# EasyEDA Pro project my_supercap_1.eprj, board 上板
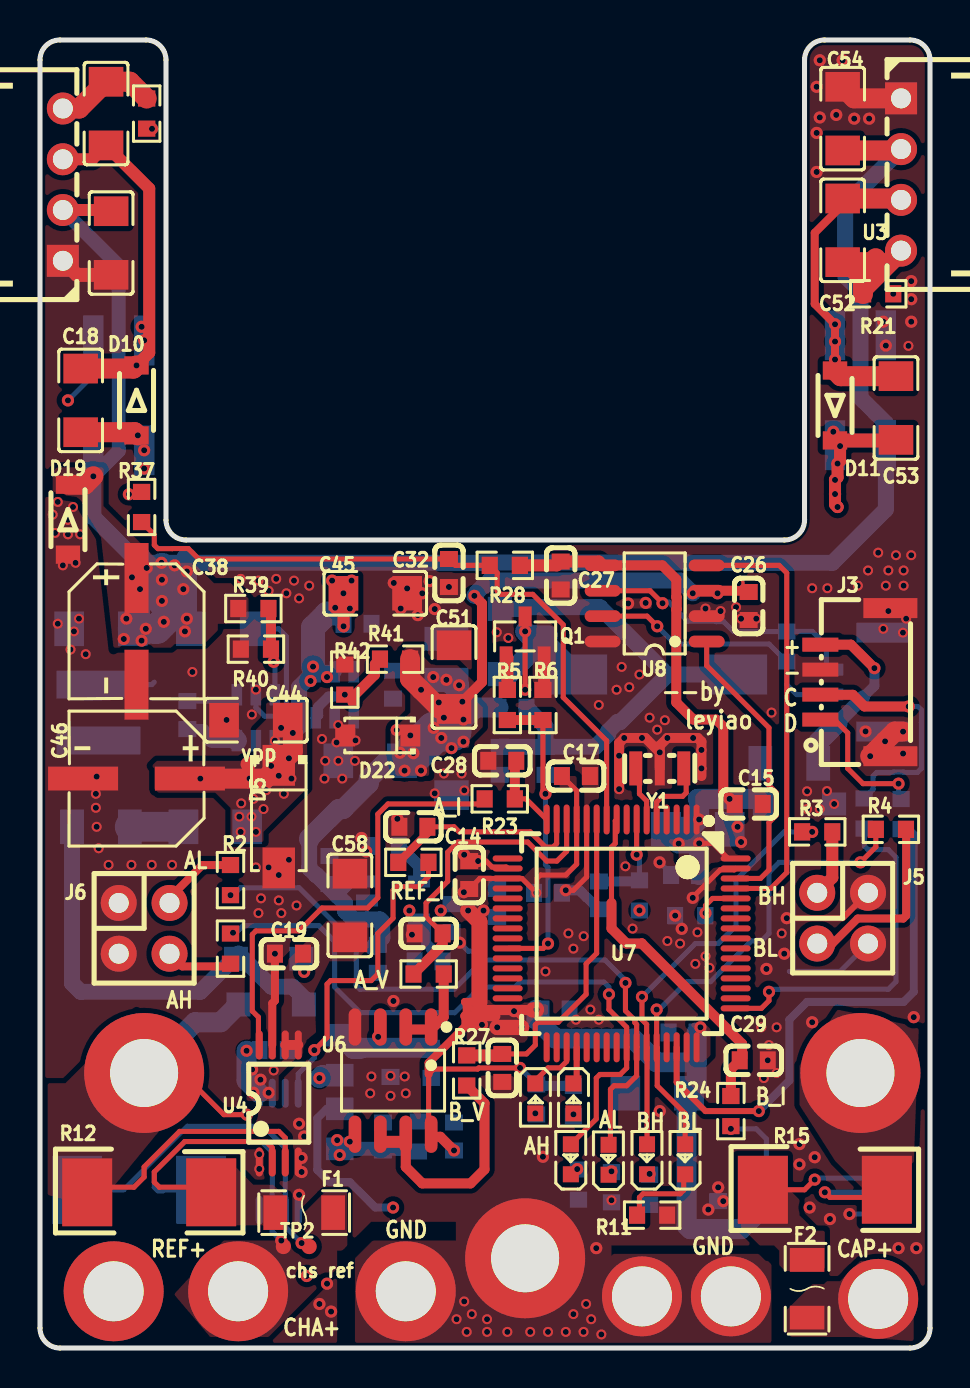
[diagram p12: board, top side]
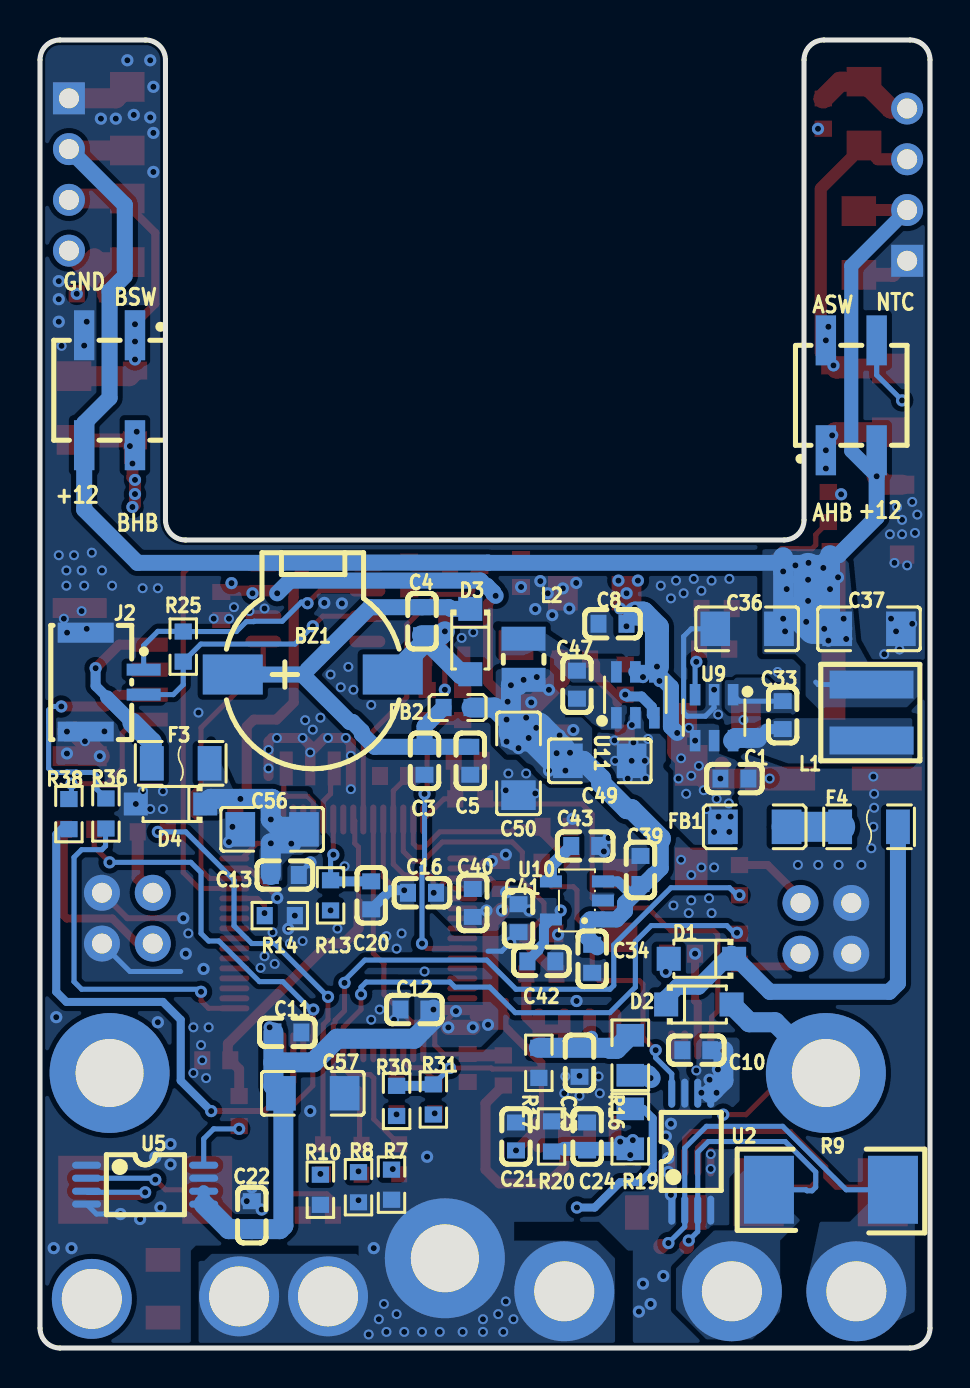
[diagram p13: board, bottom side, seen from below]

Outline 44.5 x 65.45 mm; copper layers: Top Layer, Inner1, Inner2, Bottom Layer. Coordinates in mm from the lower left corner of the outline.
Outline path: 0,64.45 arc(0.29,65.16) 1,65.45 5.3,65.45 arc(6.01,65.16) 6.3,64.45 6.3,41.43 arc(6.59,40.72) 7.3,40.43 37.23,40.43 arc(37.93,40.72) 38.23,41.43 38.23,64.45 arc(38.52,65.16) 39.23,65.45 43.5,65.45 arc(44.21,65.16) 44.5,64.45 44.5,1 arc(44.21,0.29) 43.5,0 1,0 arc(0.29,0.29) 0,1 0,64.45
Stack: Top Layer 0.035mm 外层铜厚1oz / Dielectric1 0.2104mm 7628 RC49% 8.6mil / Inner1 0.0152mm 内层铜厚 / Dielectric2 1.065mm 1.1mm H/HOZ Copper / Inner2 0.0152mm 内层铜厚 / Dielectric3 0.2104mm 7628 RC49% 8.6mil / Bottom Layer 0.035mm 外层铜厚1oz

## Design rules (mm)
net CANH: DP1
net CANL: DP1
template: 自定义配置
spacing copperThickness1oz (default): track to track 0.102, other pairs 0.152 to 0.3
spacing copperThickness2oz: track to track 0.203, other pairs 0.152 to 0.3
track width copperThickness1oz (default): min 0.127, default 0.254, max 2.54
track width copperThickness2oz: min 0.203, default 0.254, max 2.54
differential pair differentialPair (default): width min 0.127, default 0.254, max 2.54; gap min 0.152, default 0.152
via viaSize (default): diameter min 0.5, default 0.61, max 10; hole min 0.3, default 0.305, max 6.3

## Placement (name value [footprint] x y rotation side)
BZ1  2.7kHz  [BUZ-SMD_FUET-9032-XXV]  30.86 33.7 180 bottom
C1  100nF  [C0603]  9.78 28.49 0 bottom
C3  10uF  [C0603]  25.27 29.38 90 bottom
C4  20pF  [C0603]  25.4 36.37 90 bottom
C5  10uF  [C0603]  22.99 29.38 90 bottom
C8  100nF  [C0603]  15.88 36.24 180 bottom
C9  10uF  [C1206]  3.3 61.77 90 top
C10  100nF  [C0603]  11.68 14.9 180 bottom
C11  100nF  [C0603]  32.13 15.79 0 bottom
C12  100nF  [C0603]  25.78 16.94 180 bottom
C13  100nF  [C0603]  32.26 23.67 0 bottom
C14  100nF  [C0603]  21.46 23.67 270 top
C15  10uF  [C0603]  35.43 27.22 180 top
C16  10uF  [C0603]  25.4 22.78 180 bottom
C17  100nF  [C0603]  26.8 28.62 180 top
C18  10uF  [C1206]  2.03 47.42 270 top
C19  100nF  [C0603]  12.45 19.73 0 top
C20  100nF  [C0603]  27.94 22.65 90 bottom
C21  100nF  [C0603]  20.7 10.59 270 bottom
C22  100nF  [C0603]  33.91 6.65 270 bottom
C23  100nF  [C0603]  17.53 14.27 90 bottom
C24  100nF  [C0603]  17.15 10.59 270 bottom
C25  100nF  [C0603]  18.67 26.08 180 top
C26  100nF  [C0603]  35.43 37.13 90 top
C27  100nF  [C0603]  26.03 38.65 90 top
C28  100nF  [C0603]  23.11 29.38 180 top
C29  100nF  [C0603]  35.69 14.4 0 top
C30  100nF  [C0603]  19.43 20.75 180 top
C31  100nF  [C0603]  23.11 14.01 270 top
C32  100nF  [C0603]  20.45 38.78 270 top
C33  100nF  [C0603]  7.37 31.67 270 bottom
C34  10uF  [C0603]  16.89 19.48 90 bottom
C36  10uF  [C1206]  9.14 35.99 180 bottom
C37  10uF  [C1206]  3.05 35.99 0 bottom
C38  47uF  [CAP-SMD_BD6.3-L6.6-W6.6-LS7.6-FD]  4.83 35.86 270 top
C39  100nF  [C0603]  14.48 23.92 270 bottom
C40  10uF  [C0603]  20.57 21.51 90 bottom
C41  100nF  [C0603]  22.86 22.27 270 bottom
C42  10uF  [C0603]  19.43 19.35 0 bottom
C43  10nF  [C0603]  17.24 25.12 180 bottom
C44  10uF  [C1206]  10.79 31.41 0 top
C45  10uF  [C1206]  16.76 37.76 180 top
C46  47uF  [CAP-SMD_BD6.3-L6.6-W6.6-LS7.6-FD]  4.83 28.49 180 top
C47  100nF  [C0603]  17.65 33.19 90 bottom
C49  10uF  [C1206]  16.51 29.38 0 bottom
C50  10uF  [C1206]  20.57 29.25 90 bottom
C51  100uF  [C1206]  20.7 33.57 270 top
C52  10uF  [C1206]  40.13 55.92 270 top
C53  10uF  [C1206]  42.8 47.03 270 top
C54  10uF  [C1206]  40.13 61.51 270 top
C55  10uF  [C1206]  3.56 55.29 90 top
C56  100uF  [C1206]  32.89 25.95 180 bottom
C57  100uF  [C1206]  30.86 12.74 0 bottom
C58  100uF  [C1206]  15.49 22.14 270 top
chs ref  -  [Test-Point-0.5mm]  13.46 5.08 0 top
D1  DSS34  [SOD-123FL_L2.7-W1.8-LS3.8-RD]  11.56 17.19 180 bottom
D2  DSS34  [SOD-123FL_L2.7-W1.8-LS3.8-RD]  11.43 19.48 0 bottom
D3  DSS34  [SOD-123FL_L2.7-W1.8-LS3.8-RD]  22.99 35.35 270 bottom
D4  SMF3.3A  [SOD-123FL_L2.7-W1.8-LS3.7-RD]  37.97 27.22 0 bottom
D5  SMAJ28A  [SMA_L4.4-W2.8-LS5.4-RD]  11.94 26.59 270 top
D6  D-060306G1/SS2/G1  [LED0603-RD]  26.54 9.44 90 top
D7  D-060306G1/SS2/G1  [LED0603-RD]  28.43 9.42 90 top
D8  D-060306G1/SS2/G1  [LED0603-RD]  30.35 9.44 90 top
D9  D-060306G1/SS2/G1  [LED0603-RD]  32.26 9.44 90 top
D10  SMF10A  [SOD-123FL_L3.0-W1.8-LS3.7-R-RD]  4.83 47.42 270 top
D11  SMF10A  [SOD-123FL_L3.0-W1.8-LS3.7-R-RD]  39.75 47.16 90 top
D13  D-060306G1/SS2/G1  [LED0603-RD]  26.67 12.49 270 top
D14  D-060306G1/SS2/G1  [LED0603-RD]  24.76 12.49 270 top
D19  SMF10A  [SOD-123FL_L3.0-W1.8-LS3.7-R-RD]  1.4 41.45 270 top
D22  SMF5V0A  [SOD-123_L2.7-W1.8-LS3.7-RD]  16.89 30.65 180 top
F1  BSMD1206C-2300T  [F1206]  13.21 6.78 180 top
F2  BSMD1206C-2300T  [F1206]  38.35 2.97 270 top
F3  SMD1206-050-33  [F1206]  37.47 29.25 0 bottom
F4  SMD1206-050-33  [F1206]  3.05 26.08 0 bottom
FB1  BLM31PG121SN1L  [L1206]  8.76 26.08 0 bottom
FB2  BLM18PG221SN1D  [L0603]  23.62 32.05 0 bottom
J1  5BME8-08872-202-W0  [CONN-SMD_5BME8-08872-202-W0]  41.02 47.92 0 bottom
J2  WAFER-GH1.25-2PWB  [CONN-TH_2P-P1.25_XUNPU_WAFER-GH1.25-2PWB]  40.77 33.32 270 bottom
J3  LAIL-PHC1.25-4P-01-GH-WT  [CONN-SMD_4P-P1.25_HCTL_HC-GH-4PWTKK]  40.77 33.32 90 top
J4  5BME8-08872-202-W0  [CONN-SMD_5BME8-08872-202-W0]  3.94 47.67 180 bottom
J5  LAIL-PM2.54-2PX2-L  [HDR-TH_4P-P2.54-V-F-R2-C2-S2.54-ESQ-102-33-L-D]  40.13 21.51 270 top
J6  LAIL-PM2.54-2PX2-L  [HDR-TH_4P-P2.54-V-F-R2-C2-S2.54-ESQ-102-33-L-D]  5.21 21 270 top
L1  4.7uH  [IND-SMD_L4.0-W4.0_SRN4018TA]  2.92 31.79 90 bottom
L2  4.7uH  [IND-SMD_L2.5-W2.0]  20.32 34.46 90 bottom
NOREF  -  [Pad_e639]  34.54 2.58 0 top
NOREF#2  -  [Pad_e145]  41.02 13.76 0 top
NOREF#3  -  [Pad_e638]  30.1 2.58 0 top
NOREF#4  -  [Pad_e636]  9.91 2.84 0 top
NOREF#5  -  [Pad_e640]  41.91 2.46 0 top
NOREF#6  -  [Pad_e149]  24.26 4.49 0 top
NOREF#7  -  [Pad_e150]  5.21 13.76 0 top
NOREF#8  -  [Pad_e637]  18.29 2.84 0 top
NOREF#9  -  [Pad_e634]  3.68 2.84 0 top
Q1  AO3400A  [SOT-23-3_L2.9-W1.3-P1.90-LS2.4-BR]  24.26 35.6 270 top
R1  33Ω  [R0603]  9.53 19.98 270 top
R2  33Ω  [R0603]  9.53 23.41 90 top
R3  33Ω  [R0603]  38.86 25.83 0 top
R4  33Ω  [R0603]  42.54 25.95 0 top
R5  33Ω  [R0603]  23.37 32.18 90 top
R6  10kΩ  [R0603]  25.15 32.18 270 top
R7  2.2kΩ  [R0603]  26.92 8.17 270 bottom
R8  2.2kΩ  [R0603]  28.57 8.05 270 bottom
R9  2mΩ  [RES-SMD_L6.4-W3.2-1]  4.95 7.92 180 bottom
R10  2.2kΩ  [R0603]  30.48 7.92 270 bottom
R11  2.2kΩ  [R0603]  30.61 6.65 0 top
R12  2mΩ  [RES-SMD_L6.4-W3.2-1]  5.46 7.79 180 top
R13  1kΩ  [R0603]  29.97 22.65 270 bottom
R14  1kΩ  [R0603]  32.51 21.63 180 bottom
R15  2mΩ  [RES-SMD_L6.4-W3.2-1]  39.24 7.92 180 top
R16  90kΩ  [R0805]  14.99 14.65 90 bottom
R17  10kΩ  [R0603]  19.56 14.27 90 bottom
R18  68Ω  [R0603]  5.33 61.77 270 top
R19  90kΩ  [R0805]  14.99 10.97 90 bottom
R20  10kΩ  [R0603]  18.92 10.59 270 bottom
R21  68Ω  [R0603]  41.91 52.75 0 top
R22  33Ω  [R0603]  18.67 24.3 180 top
R23  33Ω  [R0603]  22.99 27.48 0 top
R24  33Ω  [R0603]  34.54 11.86 90 top
R25  120Ω  [R0603]  37.34 35.1 270 bottom
R26  33Ω  [R0603]  19.43 18.71 180 top
R27  33Ω  [R0603]  21.34 13.89 90 top
R28  10kΩ  [R0603]  23.24 39.16 0 top
R30  1kΩ  [R0603]  26.67 12.36 90 bottom
R31  1kΩ  [R0603]  24.83 12.44 90 bottom
R36  120Ω  [R0603]  41.2 26.75 90 bottom
R37  33Ω  [R0603]  5.08 42.08 270 top
R38  120Ω  [R0603]  43.05 26.71 90 bottom
R39  118kΩ  [R0603]  10.67 37 180 top
R40  10kΩ  [R0603]  10.79 34.97 0 top
R41  53.6kΩ  [R0603]  17.75 34.47 0 top
R42  10kΩ  [R0603]  15.24 33.45 270 top
TP1  -  [Test-Point-0.5mm]  10.41 29.21 0 top
TP2  -  [Test-Point-0.5mm]  12.17 5.08 0 top
U1  260kHz  [PWRM-TH_4P-L11.5-W6.1-P2.54_1]  1.14 58.21 90 top
U2  INA240A1PWR  [TSSOP-8_L4.4-W3.0-P0.65-LS6.4-BL]  11.94 9.82 180 bottom
U3  260kHz  [PWRM-TH_4P-L11.5-W6.1-P2.54_1]  43.05 58.72 270 top
U4  INA240A1PWR  [TSSOP-8_L4.4-W3.0-P0.65-LS6.4-BL]  11.94 12.24 0 top
U5  INA240A1PWR  [TSSOP-8_L4.4-W3.0-P0.65-LS6.4-BL]  39.24 8.17 270 bottom
U6  GS8332-SR  [SOP-8_L4.9-W3.9-P1.27-LS6.0-BL]  17.65 13.38 180 top
U7  STM32F334R8T6  [LQFP-64_L10.0-W10.0-P0.50-LS12.0-BL]  29.08 20.75 180 top
U8  SIT1042AT/3  [SOIC-8_L4.9-W3.9-P1.27-LS6.0-BL]  30.73 37.26 90 top
U9  RY8411  [SOT-23-6_L2.9-W1.6-P0.95-LS2.8-TL]  10.79 31.54 270 bottom
U10  RS3236-3.3YF5  [SOT-23-5_L3.0-W1.7-P0.95-LS2.8-BR]  17.65 22.4 180 bottom
U11  RY8411  [SOT-23-6_L2.9-W1.6-P0.95-LS2.8-TL]  14.73 32.68 90 bottom
Y1  8MHz  [OSC-SMD_3P-L3.2-W1.3-P1.2-L]  30.99 29 180 top

## Footprints (pads in the part's own frame, mm; a bottom-side part is the same pattern mirrored in y, then rotated)
BUZ-SMD_FUET-9032-XXV
  rect 3x2 smd: 1(-4,0) 2(4,0)
C0603
  rect 0.8x0.9 smd: 1(-0.7,0) 2(0.7,0)
C1206
  rect 1.485x1.728 smd: 1(-1.593,0) 2(1.593,0)
CAP-SMD_BD6.3-L6.6-W6.6-LS7.6-FD
  rect 3.5x1.2 smd: 1(-2.67,0) 2(2.67,0)
CONN-SMD_4P-P1.25_HCTL_HC-GH-4PWTKK
  rect 0.7x1.8 smd: 1(-1.875,1.75) 2(-0.625,1.75) 3(0.625,1.75) 4(1.875,1.75)
  rect 1x2.7 smd: 5(3.705,-1.75) 6(-3.705,-1.75)
CONN-SMD_5BME8-08872-202-W0
  rect 1.02x2.5 smd: 1(-1.27,-2.75) 2(-1.27,2.75) 3(1.27,-2.75) 4(1.27,2.75)
CONN-TH_2P-P1.25_XUNPU_WAFER-GH1.25-2PWB
  rect 0.6x1.7 smd: 1(-0.625,1.45) 2(0.625,1.45)
  rect 1x2.8 smd: 3(-2.475,-1.45) 4(2.475,-1.45)
F1206
  rect 1.19x1.728 smd: 1(-1.445,0) 2(1.445,0)
HDR-TH_4P-P2.54-V-F-R2-C2-S2.54-ESQ-102-33-L-D
  round 1.8 hole 1: 1(-1.27,-1.27) 2(-1.27,1.27) 3(1.27,-1.27) 4(1.27,1.27)
IND-SMD_L2.5-W2.0
  rect 1.2x2.2 smd: 1(1.028,0) 2(-1.028,0)
IND-SMD_L4.0-W4.0_SRN4018TA
  rect 1.4x4.2 smd: 1(-1.4,0) 2(1.4,0)
L0603
  rect 0.8x0.864 smd: 1(-0.7,0) 2(0.7,0)
L1206
  rect 1.485x1.728 smd: 1(-1.593,0) 2(1.593,0)
LED0603-RD
  rect 0.8x0.8 smd: 1(-0.749,0) 2(0.749,0)
LQFP-64_L10.0-W10.0-P0.50-LS12.0-BL
  oval 0.3x1.5 smd: 1(-3.75,-5.7) 2(-3.25,-5.7) 3(-2.75,-5.7) 4(-2.25,-5.7) 5(-1.75,-5.7) 6(-1.25,-5.7) 7(-0.75,-5.7) 8(-0.25,-5.7) 9(0.25,-5.7) 10(0.75,-5.7) 11(1.25,-5.7) 12(1.75,-5.7) 13(2.25,-5.7) 14(2.75,-5.7) 15(3.25,-5.7) 16(3.75,-5.7) 33(3.75,5.7) 34(3.25,5.7) 35(2.75,5.7) 36(2.25,5.7) 37(1.75,5.7) 38(1.25,5.7) 39(0.75,5.7) 40(0.25,5.7) 41(-0.25,5.7) 42(-0.75,5.7) 43(-1.25,5.7) 44(-1.75,5.7) 45(-2.25,5.7) 46(-2.75,5.7) 47(-3.25,5.7) 48(-3.75,5.7)
  oval 1.5x0.3 smd: 17(5.7,-3.75) 18(5.7,-3.25) 19(5.7,-2.75) 20(5.7,-2.25) 21(5.7,-1.75) 22(5.7,-1.25) 23(5.7,-0.75) 24(5.7,-0.25) 25(5.7,0.25) 26(5.7,0.75) 27(5.7,1.25) 28(5.7,1.75) 29(5.7,2.25) 30(5.7,2.75) 31(5.7,3.25) 32(5.7,3.75) 49(-5.7,3.75) 50(-5.7,3.25) 51(-5.7,2.75) 52(-5.7,2.25) 53(-5.7,1.75) 54(-5.7,1.25) 55(-5.7,0.75) 56(-5.7,0.25) 57(-5.7,-0.25) 58(-5.7,-0.75) 59(-5.7,-1.25) 60(-5.7,-1.75) 61(-5.7,-2.25) 62(-5.7,-2.75) 63(-5.7,-3.25) 64(-5.7,-3.75)
OSC-SMD_3P-L3.2-W1.3-P1.2-L
  rect 0.65x1.7 smd: 1(-1.2,0) 3(1.2,0)
  rect 0.5x1.7 smd: 2(0,0)
Pad_e145
  round 6 hole 3.4: 1(0,0)
Pad_e149
  round 6 hole 3.4: 1(0,0)
Pad_e150
  round 6 hole 3.4: 1(0,0)
Pad_e634
  round 5 hole 3: 1(0,0)
Pad_e636
  round 5 hole 3: 1(0,0)
Pad_e637
  round 5 hole 3: 1(0,0)
Pad_e638
  round 4 hole 3: 1(0,0)
Pad_e639
  round 4 hole 3: 1(0,0)
Pad_e640
  round 4 hole 3: 1(0,0)
PWRM-TH_4P-L11.5-W6.1-P2.54_1
  rect 1.6x1.6 hole 1: 1(-3.81,0)
  round 1.6 hole 1: 2(-1.27,0) 3(1.27,0) 4(3.81,0)
R0603
  rect 0.806x0.864 smd: 1(-0.753,0) 2(0.753,0)
R0805
  rect 1.133x1.377 smd: 1(-1,0) 2(1,0)
RES-SMD_L6.4-W3.2-1
  rect 2.5x3.4 smd: 1(-3.1,0) 2(3.1,0)
SMA_L4.4-W2.8-LS5.4-RD
  rect 2.046x1.62 smd: 1(-2.566,0) 2(2.566,0)
SOD-123_L2.7-W1.8-LS3.7-RD
  rect 1x1.1 smd: 1(-1.627,0) 2(1.627,0)
SOD-123FL_L2.7-W1.8-LS3.7-RD
  rect 1.2x1.15 smd: 1(-1.735,0) 2(1.735,0)
SOD-123FL_L2.7-W1.8-LS3.8-RD
  rect 1.2x1.2 smd: 1(-1.635,0) 2(1.635,0)
SOD-123FL_L3.0-W1.8-LS3.7-R-RD
  rect 0.909x1.219 smd: 1(1.75,0) 2(-1.75,0)
SOIC-8_L4.9-W3.9-P1.27-LS6.0-BL
  oval 0.588x1.8 smd: 1(-1.905,-2.6) 2(-0.635,-2.6) 3(0.635,-2.6) 4(1.905,-2.6) 5(1.905,2.6) 6(0.635,2.6) 7(-0.635,2.6) 8(-1.905,2.6)
SOP-8_L4.9-W3.9-P1.27-LS6.0-BL
  oval 0.63x1.865 smd: 1(-1.905,-2.683) 2(-0.635,-2.683) 3(0.635,-2.683) 4(1.905,-2.683) 5(1.905,2.683) 6(0.635,2.683) 7(-0.635,2.683) 8(-1.905,2.683)
SOT-23-3_L2.9-W1.3-P1.90-LS2.4-BR
  rect 1x0.65 smd: 1(1,-0.95) 2(1,0.95) 3(-1,0)
SOT-23-5_L3.0-W1.7-P0.95-LS2.8-BR
  rect 1.1x0.6 smd: 1(1.3,-0.95) 2(1.3,0) 3(1.3,0.95) 4(-1.3,0.95) 5(-1.3,-0.95)
SOT-23-6_L2.9-W1.6-P0.95-LS2.8-TL
  rect 1.072x0.532 smd: 1(-1.149,0.95) 2(-1.149,0) 3(-1.149,-0.95) 4(1.149,-0.95) 5(1.149,0) 6(1.149,0.95)
Test-Point-0.5mm
  round 0.762 smd: 1(0,0)
TSSOP-8_L4.4-W3.0-P0.65-LS6.4-BL
  oval 0.353x1.454 smd: 1(-0.975,-2.927) 2(-0.325,-2.927) 3(0.325,-2.927) 4(0.975,-2.927) 5(0.975,2.927) 6(0.325,2.927) 7(-0.325,2.927) 8(-0.975,2.927)

## Nets
As in the schematic, except:
GND: C1.1 C3.1 C5.1 C8.1 C10.1 C11.1 C12.1 C13.1 C14.1 C15.1 C16.1 C17.1 C19.1 C20.1 C21.1 C22.1 C23.1 C24.1 C25.2 C26.1 C27.1 C28.2 C29.2 C30.2 C31.2 C32.2 C34.1 C36.1 C37.1 C38.2 C39.1 C40.1 C41.1 C42.1 C43.2 C44.1 C45.1 C46.2 C49.1 C50.1 C51.1 C54.1 C55.1 C56.1 C57.1 C58.1 D4.2 D5.2 D19.1 D22.2 J1.3 J2.3 J2.4 J3.3 J3.5 J3.6 J5.2 J5.4 J6.1 J6.3 NOREF.1 NOREF#3.1 NOREF#6.1 NOREF#8.1 Q1.2 R6.1 R7.2 R8.2 R10.2 R11.2 R14.2 R17.1 R20.1 R40.1 R42.1 U1.1 U2.1 U2.4 U2.7 U3.1 U4.1 U4.4 U4.7 U5.1 U5.4 U5.7 U6.4 U7.12 U7.18 U7.31 U7.47 U7.63 U8.2 U8.8 U9.2 U10.2 U11.2 Y1.2
A_POWER: D1.2 NOREF#7.1 R12.2 R16.1 U4.3
B_POWER: D2.2 NOREF#2.1 R15.1 R19.2 U5.3
CAP+: F2.2 NOREF#5.1
CHASSIS+: F1.1 NOREF#4.1 R9.1 TP2.1 U2.3
REFEREE+: chs ref.1 NOREF#9.1 R9.2 U2.2

Pads without a net: U7 2 3 4 8 17 20 21 22 23 24 25 27 28 29 30 33 34 45 50 51 52 53 54 55 56 57 58 59

## Via types
v1: diameter 0.61, hole 0.305, Top Layer to Bottom Layer, 203 vias
v2: diameter 0.7, hole 0.305, Top Layer to Bottom Layer, 1 via
v3: diameter 0.5, hole 0.3, Top Layer to Bottom Layer, 126 vias
v4: diameter 0.5, hole 0.305, Top Layer to Bottom Layer, 44 vias

## Routing (per net, layer and track width the routed paths; a pad name or vN(x,y) marks a point on that pad's centre or on a via; arc(x,y) is an arc through that point)
5V_FB: length 4.9
  Top Layer w0.5: 15.63,32.31 15.63,32.56 16.74,33.68 16.74,34.21 R41.1
  Bottom Layer w0.5: v1(15.24,32.69) 15.15,32.6 14.43,32.6 13.91,32.08 13.91,31.66 U11.3
12V_FB: length 4.4
  Top Layer w0.254: R40.2 11.68,34.83 v1(11.68,34.33)
  Top Layer w0.5: R39.1 11.55,36.87 R40.2
  Bottom Layer w0.254: v1(11.68,34.33) 11.75,34.27 U9.3
+3.3V: length 134.4
  Top Layer w0.254: C14.2 21.99,23.5 U7.19 24.1,23.5 v4(24.82,22.78) ; v1(23.7,16.86) 24.08,16.48 v1(24.08,16.04) ; C17.2 26.83,27.88 U7.13 26.83,24.21 26.29,23.67 25.02,23.67 24.84,23.49 24.84,22.78 ; U6.8 19.43,10.82 19.43,13.7 19.69,13.96 21.88,13.96 21.94,14.01 v1(24,14.01) ; U7.64 34.4,24.5 33.65,25.25 v1(32.96,25.25) ; 21.34,17.23 22.1,16.47 v1(22.1,16.17)
  Top Layer w0.4: 19.43,13.7 19.43,14.27 21.27,16.11 21.27,16.6 ; 21.34,16.67 21.34,17.23 21.25,17.32 21.97,17.32
  Top Layer w0.5: v1(34.48,27.48) 34.16,27.79 34.16,31.09 33.81,31.45 32.67,31.45 31.81,32.3 31.81,36.95 31.83,36.97 31.83,37.56 31.81,37.58 31.81,38.46 31.12,39.16 U8.5 ; 21.34,16.67 21.27,16.6 ; 19.56,10.57 20.02,10.57 v1(20.7,9.89) ; U4.5 12.26,15.16
  Top Layer w0.508: 21.27,16.6 22.76,16.6 ; 24.64,16.91 22.05,16.91 ; v1(22.1,16.17) 21.46,16.17
  Top Layer w0.6: U8.5 27.94,39.35 C27.2 25.84,39.16 R28.2
  Top Layer w0.762: 24.64,16.91 24.8,16.91 v1(24.83,16.94) ; v1(22.86,16.05) 22.87,16.04 v1(24.08,16.04)
  Top Layer w0.8: v1(21.41,21.89) 21.97,21.32 21.97,17.32 ; 21.97,16.86 21.97,16.75
  Inner2 w1: 20.57,21.89 v1(21.41,21.89) v1(22.18,21.89) ; 20.57,22.78 20.57,22.42 v1(20.04,21.89) v1(18.47,21.89) 16.75,21.89 15.75,20.89 15.75,19.08 v1(10.6,13.94) ; v1(21.19,22.81) 21.26,22.81 v1(22.18,21.89) ; v1(22.18,21.89) 30.23,21.89 31.94,23.6 v1(31.94,25.24)
  Bottom Layer w0.254: R31.2 24.01,14.01 v1(24,14.01)
  Bottom Layer w0.5: U10.5 19.3,21.1 19.3,20.26 19.58,19.99 19.58,19.9 C42.2 ; R30.2 24.91,13.12 R31.2
  Bottom Layer w0.6: U5.6 U5.5
  Bottom Layer w1: v1(10.33,14.87) 10.33,13.38 U2.5 ; 32.83,14.3 30.83,14.3 29.65,15.48 25.79,15.48 24.83,16.44 v1(24.83,16.94) ; 32.83,14.3 32.83,13.12 C57.2 ; 32.83,14.3 C11.2 ; 32.33,12.62 32.33,6.13 32.51,5.95 C22.2 35.07,5.95 U5.5 ; C13.2 v1(32.96,25.25) 32.94,25.24 v1(31.94,25.24) ; C56.2 31.43,26.08 32.59,26.08 v1(32.96,26.45) 32.96,27.41 32.89,27.48 v1(34.48,27.48) 35.98,27.48 D4.1
  vias: v1(10.67,12.77) v1(11.02,13.43) v1(11.43,12.77) v1(29.97,21.9) v1(33.02,16.05) v3(11.68,13.89)
+5V: length 48
  Top Layer w0.254: 35.37,37.89 34.99,38.27 v1(34.93,38.27)
  Top Layer w0.5: 20.76,31.98 v1(21.12,32.34) 22.1,33.32 22.1,37.26 v1(21.72,37.64) ; C26.2 35.37,37.89 U8.3
  Top Layer w1: R41.2 18.5,33.48 v1(19.05,32.93) 20.01,31.98 C51.2
  Bottom Layer w0.5: 14.88,22.62 15.6,23.35 U10.3
  Bottom Layer w0.8: v1(32.64,37.76) 32,38.4 22.48,38.4 22.22,38.14 22.16,38.14 21.84,37.81 21.84,37.75 v1(21.72,37.64) ; 13.46,25.44 13.46,24.01 13.8,23.67 13.83,23.67 14.88,22.62 15.25,22.25 15.25,21.87 15.67,21.45 U10.1 16.99,21.45 17.12,21.32 17.12,20.53 16.64,20.05
  Bottom Layer w1: FB2.1 21.78,32.05 v1(21.17,31.44) 20.96,31.23 v1(20.96,33.16) 20.59,33.16 v1(20.32,33.43) ; 18.23,29.38 17.34,29.38 16.44,28.48 16.44,28.25 15.15,26.96 14.92,26.96 13.46,25.5 13.46,25.44
  Bottom Layer w2: v1(18.67,29.76) 19.75,30.85 C50.2
  vias: v1(17.84,30.92) v1(18,29.79) v1(18.23,28.89) v1(18.52,30.65) v1(19.05,28.89) v1(19.66,33.57) v1(19.69,31.03) v1(19.94,32.3) v1(20.07,30.52) v1(20.19,31.54) v1(20.57,30.02) v1(21.17,30.34) v1(33.88,37.76)
+12V: length 100.7
  Top Layer w0.6: C55.2 3.5,56.94 U1.2
  Top Layer w1: U3.2 42.98,59.92 C54.2 ; D19.2 2.25,43.2 v2(2.67,43.62)
  Bottom Layer w0.254: 5.72,33.32 5.59,33.19 L1.2
  Bottom Layer w0.7: U1.2 3.94,54.15 3.94,44.89 v2(2.67,43.62)
  Bottom Layer w0.8: 40.26,53.64 41.02,52.88 41.02,47.54 42.29,46.27 J1.4 42.29,41.95 39.62,39.29 32.39,39.29 32.38,39.3 22.11,39.3 22.09,39.29 v1(6.08,39.29) 5.38,39.29 5,39.67 4.57,39.67 2.67,41.57 v2(2.67,43.62) J4.3 ; 40.26,53.89 40.26,57.19 U3.2
  Bottom Layer w1: C36.2 7.34,36.19 v1(7.34,38.86) 7.34,39.57 ; C37.2 5,36.34 v1(5,37.97) 5,39.67
  Bottom Layer w1.5: 6.1,39.03 v1(6.1,38.44) v1(6.1,37.38) ; 6.35,36.87 6.35,37 ; C37.2 v1(5.29,35.99) 5.84,35.99 6.35,36.49
  vias: v1(4.19,35.48) v1(4.32,36.49) v1(4.6,38.56) v1(5.08,35.4) v1(5.33,39.03) v1(6.19,36.33) v1(6.73,39.16) v1(7.17,37.97) v1(7.25,35.86) v1(7.34,36.49)
GND: length 57.2
  Top Layer w0.254: U7.18 23.31,24.07 22.61,24.07 22.31,24.37 v1(21.91,24.37) C14.1 ; v1(26.29,22.9) 26.67,22.9 27.33,23.57 U7.12 ; v1(32.64,22.52) 32.64,22.56 34.01,23.92 34.71,23.92 U7.63
  Top Layer w0.3: v1(37.34,21.51) 40.13,21.51 J5.2
  Top Layer w0.4: v1(11.75,19.73) 11.75,17.38 11.61,17.25 U4.7
  Top Layer w0.5: v4(30.99,29.8) 30.99,30.14 v4(31.37,30.52) 32.89,30.52 33.07,30.35 v4(33.07,29.93) v4(33.07,29) 33.07,28.62 ; v4(30.99,29.8) 30.27,30.52 v4(30.1,30.52) v4(29.21,30.52) 28.96,30.27 v4(28.96,29.64) v4(28.96,27.97) ; v4(30.99,29.8) Y1.2
  Top Layer w0.6: R6.1 25.21,32.99 Q1.2
  Top Layer w0.7: C55.1 1.85,53.7 U1.1
  Top Layer w1: v1(41.51,29.61) v3(42.25,30.36) 42.74,30.84 v1(43.15,30.84) ; U3.1 40.71,62.53 C54.1
  Bottom Layer w0.254: U9.2 10.79,32.05 11.23,31.62 12.14,31.62 12.32,31.79 12.32,35.6 11.94,35.99 C36.1 ; v1(40.47,6.7) 41.68,6.7 U5.4 ; C40.1 20.57,20.7 v1(20.99,20.28) 21.41,19.86 22.1,19.86 ; C13.1 31.56,23.72 v1(30.98,24.3) ; 37.47,18.84 40,18.84 J5.4
  Bottom Layer w0.5: C20.1 27.34,22.55 27.32,22.55 27.09,22.78 27.09,22.8 26.99,22.9 v1(26.29,22.9)
  vias: v1(12.95,11.22) v1(12.95,7.66) v1(13.08,9.51) v1(13.08,8.81) v1(13.21,10.59) v1(13.34,3.6) v1(13.97,2.2) v1(14.35,3.22) v1(14.55,1.82) v1(16.07,25.52) v1(16.31,24.85) v1(17.69,38.28) v1(17.67,17.36) v1(17.87,26.48) v1(18.03,37) v1(18.36,38.01) v1(18.6,20.68) v1(18.89,36.67) v1(19.11,37.76) v1(19.48,38.37) v1(19.74,36.97) v1(20.45,38.08) v1(21.21,24.68) v1(25.15,9.57) v1(27.81,5) v1(29.41,37.26) v1(30.28,37.28) v1(30.99,11.86) v1(31.76,21.63) v1(32.09,20.97) v1(33.42,6.93) v1(33.91,8.04) v1(34.16,7.35) v1(34.88,26.08) v1(35.05,25.32) v1(36.32,18.97) v1(37.21,19.73) v1(37.97,10.2) v1(37.97,9.19) v1(38.48,7.03) v1(38.61,16.3) v1(38.74,9.55) v1(38.83,63.11) v1(38.83,60.8) v1(38.83,58.85) v1(38.99,64.43) v1(38.99,61.57) v1(39.5,6.45) v1(39.81,61.7) v1(40.13,64.43) v1(40.71,61.51) v1(41.28,30.85) v1(41.46,61.51) v1(42.16,51.35) v1(42.29,50.16) v1(42.93,5) v1(43.15,29.75) v1(43.56,53.38) v1(43.56,52.48) v1(43.56,51.35) v1(43.69,16.55) v1(43.81,5) v3(0.63,41.7) v3(0.75,40.78) v3(0.89,42.34) v3(0.89,36.24) v3(1.14,39.16) v3(1.4,41.44) v3(1.4,40.72) v3(1.53,34.95) v3(1.65,42.08) v3(1.7,35.86) v3(1.78,39.29) v3(1.95,36.49) v3(2.01,40.72) v3(2.29,34.72) v3(7.62,33.83) v3(9.33,31.43) v3(10.03,38.49) v3(10.59,31.7) v3(10.79,32.94) v3(10.79,24.05) v3(10.92,38.4) v3(10.92,21.76) v3(11.05,22.5) v3(11.43,37.89) v3(11.43,24.05) v3(11.81,38.49) v3(11.94,23.67) v3(11.94,22.4) v3(12.06,21.76) v3(12.32,37.76) v3(12.45,24.43) v3(12.7,38.4) v3(12.83,22.14) v3(12.95,37.51) v3(13.46,38.14) v3(14.1,30.47) v3(14.22,28.49) v3(14.26,29.38) v3(14.83,30.3) v3(14.91,31.17) v3(14.92,29.38) v3(15.11,28.49) v3(15.75,29.38) v3(15.78,30.4) v3(16.51,12.74) v3(16.57,13.59) v3(17.53,13.62) v3(17.53,12.62) v3(18.24,13.59) v3(18.29,12.74) v3(19.74,27.75) v3(20.19,28.75) v3(20.83,1.44) v3(21.08,28.75) v3(21.21,27.9) v3(21.21,2.33) v3(21.34,0.81) v3(21.59,1.7) v3(22.35,1.44) v3(22.35,0.81) v3(22.84,35.81) v3(23.42,35.53) v3(23.37,0.81) v3(24.51,0.81) v3(25.27,18.84) v3(25.4,0.81) v3(26.29,0.81) v3(26.42,20.75) v3(26.67,19.98) v3(26.67,1.7) v3(26.8,16.43) v3(27.18,20.61) v3(27.18,0.81) v3(27.31,2.2) v3(27.52,16.94) v3(27.56,1.44) v3(27.94,32.18) v3(27.94,16.43) v3(28.07,0.68) v3(28.57,7.4) v3(28.83,32.94) v3(29.08,34.08) v3(29.27,24.1) v3(29.46,33.06) v3(29.63,20.99) v3(29.97,33.7) v3(30.48,31.54) v3(30.86,30.94) v3(31.24,31.41) v3(31.37,20.36) v3(32,20.24) v3(32.77,19.22) v3(32.87,20.8) v3(33.27,19.6) v3(33.47,19.02) v3(36.07,16.05) v3(36.19,13.51) v3(36.45,15.16) v3(36.39,14.4) v3(36.83,16.05) v3(36.83,13.76) v3(37.08,20.75) v3(38.35,27.86) v3(38.35,26.97) v3(38.61,38.02) v3(38.99,26.97) v3(39.35,27.87) v3(39.37,38.02) v3(39.71,27.22) v3(40.89,38.14) v3(41.4,38.91) v3(41.91,39.8) v3(42.16,35.99) v3(42.29,38.14) v3(42.42,38.91) v3(42.42,36.87) v3(42.8,39.67) v3(43.15,35.79) v3(43.18,38.91) v3(43.18,38.14) v3(43.31,36.49) v3(43.42,50.14) v3(43.56,39.67) v4(2.83,28.59) v4(2.79,27.73) v4(2.79,27.03) v4(2.83,26.08) v4(2.94,25.01) v4(3.43,24.17) v4(4.57,24.17) v4(5.59,24.17) v4(6.6,24.17) v4(10.96,9.7) v4(10.96,8.96) v4(32.66,30.52) v4(33.27,37) v4(34.03,36.87) v4(34.8,37.07) v4(35.05,36.49) v4(35.81,36.49) v4(36.58,31.79)
A_H: length 32.8
  Top Layer w0.254: v1(28.45,17.7) 28.45,16.94 29.33,16.05 U7.41 29.33,14.01 29.01,13.69 27.99,13.69 27.81,13.51 27.81,11.46 D6.2
  Bottom Layer w0.254: v1(28.45,17.7) 28.45,18.06 28.19,18.31 24,18.31 23.75,18.06 22.01,18.06 20.74,16.78 16.01,16.78 14.73,18.06 14.73,20.34 13.94,21.14 10.16,21.14 9.8,20.78 v1(9.65,20.78)
A_H_OUT: length 3.4
  Top Layer w0.4: R1.2 9.39,19.09 7.11,19.09 J6.4
A_HB: length 20
  Top Layer w1: C18.2 4.73,45.82 v1(4.89,45.67)
  Inner2 w0.8: v1(4.89,45.67) 3.56,47 3.56,56.76 4.12,57.32 4.69,57.32 5.33,57.97 5.33,60.74 v1(5.6,61)
  vias: v1(5.21,44.92) v1(5.21,44.01)
A_I: length 22.6
  Top Layer w0.254: R23.1 21.98,27.22 17.4,27.22 16.89,26.71 16.89,22.52 16.38,22.02 14.1,22.02 12.95,20.87 10.79,20.87 10.62,20.69 10.62,16.86 10.92,16.55 10.92,15.2 U4.8
A_I_ADC: length 4
  Top Layer w0.254: U7.16 24.3,27.48 R23.2
  Top Layer w0.5: R23.2 23.74,29.31 C28.1
A_L: length 33.6
  Top Layer w0.254: D7.2 28.52,10.26 28.52,12.95 28.7,13.13 29.34,13.13 29.83,13.62 U7.42 29.83,16.19 29.74,16.28 29.74,16.4 29.27,16.87 v1(29.27,18.27)
  Bottom Layer w0.254: v1(29.27,18.27) 29.27,18.4 28.26,19.41 22.16,19.41 20.7,17.95 16,17.95 15.81,18.14 15.81,20.17 12.95,23.03 10.02,23.03 9.65,22.66 v1(9.53,22.66)
A_L_OUT: length 4
  Top Layer w0.4: J6.2 6.48,22.52 8.12,24.17 R2.2
A_POWER: length 30.4
  Top Layer w0.254: v1(10.34,11.68) 9.19,11.68 7.11,13.76 NOREF#7.1 ; 12.26,9.31 12.26,10.51 11.94,10.84 6.99,10.84 5.21,9.06 5.21,8.55 4.7,8.05 2.62,8.05 2.36,7.79
  Inner2 w0.4: v1(10.34,11.68) 10.64,11.98 12.45,11.98 v1(13.97,13.51)
  Bottom Layer w1: D1.2 9.03,16.3 7.75,16.3 NOREF#7.1 ; R16.1 14.11,13.65 v1(13.97,13.51)
A_SW: length 17.5
  Top Layer w0.6: 1.14,59.48 2.61,59.48 C9.1 5.46,58.02 5.46,49.8 v1(4.83,49.17)
  Top Layer w1: C18.1 4.67,49.01 v1(4.83,49.17)
  vias: v1(5.08,51.1) v1(5.21,50.42)
B_H: length 21.3
  Top Layer w0.254: D8.2 30.35,15.03 U7.43 30.33,16.19 30.1,16.43 v1(30.1,17.57) ; R3.1 v1(38.61,25.83)
  Bottom Layer w0.254: v1(38.61,25.83) 37.21,25.83 34.8,23.41 34.8,21.13 33.91,20.24 32.77,20.24 v1(30.1,17.57)
B_H_OUT: length 3.4
  Top Layer w0.6: R3.2 39.62,23.53 J5.1
B_HB: length 18.7
  Top Layer w0.6: D11.2 39.75,45.38 v1(40,45.13) 40,44.38 v1(39.88,44.25) 39.88,43.56 v1(39.75,43.44) v1(39.75,42.73) 39.75,42.21 v1(39.88,42.08)
  Top Layer w0.7: C53.2 42.77,45.41 D11.2
  Inner2 w0.5: v1(42.66,52.75) 42.14,52.75 41.28,51.89 ; 41.28,51.78 41.28,43.48 v1(39.88,42.08)
  vias: v1(39.66,45.85)
B_L: length 24.3
  Top Layer w0.254: v1(30.83,16.94) U7.44 30.86,15.02 30.86,13.13 32.26,11.73 D9.2 ; v1(41.02,24.3) 41.79,25.07 R4.1
  Bottom Layer w0.254: v1(41.02,24.3) 36.96,24.3 36.45,23.79 36.45,20.75 36.07,20.36 35.56,20.36 33.53,18.33 32.36,18.33 30.96,16.94 v1(30.83,16.94)
B_L_OUT: length 9.3
  Top Layer w0.4: J5.3 39.63,20.24 40.88,21.49 43.16,21.49 43.31,21.63 43.31,25.94 R4.2
B_POWER: length 75.3
  Top Layer w0.254: v1(39.24,7.79) 39.5,7.54 41.96,7.54 R15.1
  Inner2 w1: NOREF#2.1 41.15,13.76 42.48,12.43 42.48,7.47 41.43,6.42 41.43,6.31 40.62,5.5 39.1,5.5 38.85,5.75 28.84,5.75 26.59,8 25.37,8 24.62,8.74 21.78,8.74 21.77,8.76 21.52,8.76 19.99,7.23 14.3,7.23 13.78,6.71 13.35,6.71 13.35,6.71 12.56,6.71 12.55,6.71 7.94,6.71 7.68,6.97 7.68,10.9 9.03,12.25 9.03,16.57 9.21,16.75 10.6,16.75 13,19.14 13.02,19.14 13.21,18.95 v1(13.21,18.82)
  Bottom Layer w0.254: v1(39.24,7.79) 42.11,7.79 U5.3
  Bottom Layer w0.4: R19.2 14.34,11.97 13.87,11.5 13.87,8.91 14.48,8.3 15.49,8.3 16.76,7.03 v1(17.65,7.03)
B_SW: length 15.7
  Top Layer w0.4: C52.1 40.13,57.19 38.74,55.8 38.74,52.24 v1(39.75,51.23) v1(39.75,50.36) v1(39.75,49.46) D11.1
  Top Layer w1: U3.3 42.98,57.52 C52.1 ; C53.1 40.04,48.63 D11.1
BUZZER: length 15.2
  Top Layer w0.254: U7.26 25.16,20 v1(25.4,20.24) ; R6.2 25.15,27.86 v1(25.27,27.73)
  Top Layer w0.5: R5.1 R6.2
  Bottom Layer w0.254: v1(25.27,27.73) 25.27,24.17 25.4,24.05 v1(25.4,20.24)
CAN_RX: length 22
  Top Layer w0.254: U7.61 36.54,23 37.34,23.79 37.34,38.78 36.96,39.16 U8.4
CAN_TX: length 14.9
  Top Layer w0.254: U7.62 36.02,23.5 36.45,23.92 36.45,26.29 36.81,26.66 36.81,27.79 36.45,28.15 36.45,31.03 33.33,34.15 U8.1
CANH: length 13.5
  Top Layer w0.254: v1(30.86,36.11) 30.35,36.62 28.13,36.62
  Bottom Layer w0.254: J2.2 37.84,32.69 37.34,33.19 R25.2 36.46,35.22 31.75,35.22 v1(30.86,36.11)
CANL: length 13.6
  Top Layer w0.254: v1(31.13,37.27) 30.5,37.89 U8.6
  Bottom Layer w0.254: J2.1 39.32,35.15 38.61,35.86 37.35,35.86 R25.1 34.68,35.85 34.18,36.35 33.81,36.35 33.79,36.37 32.38,36.37 31.43,37.32 31.18,37.32 v1(31.13,37.27)
CAP_I: length 3.3
  Bottom Layer w0.254: v1(34.54,10.97) 35.81,10.97 36.32,10.46 U5.8
CAP_I_ADC: length 17.3
  Top Layer w0.254: 28.57,22.27 28.57,25.06 28.76,25.25 28.76,26.37 U7.9
  Top Layer w0.5: R24.2 34.54,13.95 C29.1 35.11,14.52 35.11,15.22 30.09,20.24 30.09,20.25 30.08,20.24 29.33,20.24 28.57,20.99 28.57,22.27
CHASSIS+: length 14.6
  Bottom Layer w0.254: R9.1 6.2,7.92 6.15,7.87 5.89,7.87 5.72,8.05 5.72,8.81 7.24,10.33 11.08,10.33 11.61,9.8 U2.3 11.61,5.83 v1(12.06,5.38)
IA+: length 10.9
  Top Layer w0.254: U4.2 11.61,10.02 11.3,10.33 7.24,10.33 5.72,8.81 5.72,8.3 5.97,8.05 8.31,8.05 R12.1
IB+: length 6.3
  Top Layer w0.254: R15.2 38.23,7.92 v1(38.74,8.43)
  Bottom Layer w0.254: U5.2 38.81,8.5 v1(38.74,8.43)
NRST: length 5.2
  Top Layer w0.254: U7.7 v1(29.83,24.68)
  Bottom Layer w0.254: R13.1 29.97,24.54 v1(29.83,24.68)
  Bottom Layer w0.5: C20.2 29.92,23.35 R13.1
NTC: length 11.6
  Top Layer w0.254: v1(4.44,42.72) 4.96,42.72 R37.1
  Inner2 w0.3: v1(1.4,47.42) 1.4,43.35 2.03,42.72 v1(4.44,42.72)
  Bottom Layer w0.254: J4.4 2.67,48.69 v1(1.4,47.42)
PB14: length 2.8
  Top Layer w0.254: U7.35 26.33,14.34 26.01,14.02 25.4,14.02 24.76,13.38 D14.1
PB15: length 1.9
  Top Layer w0.3: U7.36 26.83,13.4 D13.1
REFEREE+: length 17.3
  Bottom Layer w0.254: R9.2 4.19,7.92 7.37,11.09 11.18,11.09 12.26,10.01 12.26,6.07 v1(13.08,5.25)
REFEREE_I: length 16.1
  Top Layer w0.254: v1(13.72,14.9) 14.35,15.54 14.35,18.21 14.53,18.39 16.56,18.39 16.89,18.71 16.89,20.75 17.65,21.51 17.65,22.9 17.83,23.08 18.92,23.08 19.42,23.58 R22.1
  Bottom Layer w0.254: U2.8 12.91,13.72 13.72,14.52 v1(13.72,14.9)
REFEREE_I_ADC: length 10.5
  Top Layer w0.254: U7.15 25.83,25.24 25.65,25.06 25.27,25.06 24.51,25.83 20.96,25.83 20.7,26.08 C25.1
  Top Layer w0.4: C25.1 19.37,25.76 R22.2
SWDCK: length 17.7
  Top Layer w0.254: U7.49 36.07,17 36.45,17.38 v1(36.45,17.82)
  Bottom Layer w0.254: v1(36.45,17.82) 36.58,17.95 42.42,17.95 42.8,18.33 42.8,24.56 42.42,24.94 41.4,24.94 41.22,25.12 41.22,25.97 41.2,25.99
SWDIO: length 27
  Top Layer w0.3: U7.46 31.83,13.3 33.27,11.86 v1(35.94,11.86)
  Bottom Layer w0.4: v1(35.94,11.86) 37.47,13.38 37.47,16.43 38.35,17.32 43.18,17.32 43.69,17.82 43.69,25.7 43.24,26.15
THERMISTOR_ADC: length 34.7
  Top Layer w0.254: U7.10 28.33,30.39 26.16,32.56 26.16,36.19 24.64,37.71 23.04,37.71 22.86,37.89 22.86,38.79 R28.1 20.77,39.16 C32.1 7.94,39.48 7.41,40 6.63,40 6.62,40 5.89,40 5.72,40.18 5.72,40.69 R37.2
VASENSE: length 4.3
  Top Layer w0.5: 18.29,15.94 19.56,15.94 20.18,16.56 R26.1
VASENSE_ADC: length 15.8
  Top Layer w0.254: U7.14 26.33,24.85 25.84,24.37 25.34,24.37 24.38,25.32 20.89,25.32 20.38,24.81 20.38,23.35 19.3,22.27 19.3,21.57 C30.1
  Top Layer w0.5: C30.1 20.13,20.17 R26.2
VBSENSE: length 11.9
  Top Layer w0.5: R27.1 22.22,12.25 22.22,8.93 21.53,8.24 19.11,8.24 18.29,9.06 U6.7
  Top Layer w0.6: 17.15,10.32 18.29,10.32
VBSENSE_ADC: length 16.8
  Top Layer w0.254: U7.11 27.83,19.75 27.31,19.22 27.31,17.7 25.91,16.3 24.89,16.3 24.76,16.17 24.76,15.16 24.32,14.71 C31.1
  Top Layer w0.6: C31.1 23.04,14.64 R27.2
VPP: length 16.1
  Top Layer w0.6: v1(15.18,36.11) 15.18,37.76 v1(15.17,37.76)
  Top Layer w1: C46.1 v3(8.02,28.49) v4(10.48,28.49) 11.28,28.49 D5.1 12.64,29.86 v4(12.64,30.78)
  Bottom Layer w0.7: U11.5 U11.4
  Bottom Layer w0.8: 13.72,33.83 12.95,33.06 12.95,31.09 v4(12.64,30.78)
  Bottom Layer w1.2: 14.73,36.75 14.35,36.75 13.65,36.05 v1(13.65,34.09)
  vias: v1(13.53,33.38) v1(14.35,33.57) v1(14.6,38.4) v1(14.76,37.04) v1(15.49,37) v1(15.58,38.4) v4(9.96,26.59) v4(10.03,25.83) v4(10.06,27.25) v4(10.57,26.59) v4(10.67,27.48) v4(10.79,25.83) v4(11.18,26.97) v4(11.31,27.91) v4(11.56,29.13) v4(11.75,30.39) v4(11.94,28.63) v4(12.05,31.03) v4(12.19,27.73) v4(12.45,29.51) v4(12.57,28.49)
$2N395: length 2.6
  Bottom Layer w0.254: U9.1 9.52,32.37 C33.1
$2N400: length 2.7
  Bottom Layer w0.508: 8.64,30.52 8.19,30.97 C33.2
  Bottom Layer w1: 8.64,30.52 9.71,30.52 U9.6
$2N2458: length 2.2
  Bottom Layer w0.6: C43.1 18.95,24.11 U10.4
$3N995: length 6.3
  Top Layer w1: 41.15,53 U3.4 ; 41.15,53 41.15,52.74 ; 41.15,53 41.15,53.55 40.37,54.33 ; C52.2 40.37,54.33 ; 40.37,54.33 41.59,54.33 41.78,54.53
$3N1072: length 5.1
  Top Layer w1: R18.1 4.5,63.36 C9.2 1.96,62.02 U1.4
$4N2424: length 21.6
  Bottom Layer w0.8: D1.1 13.19,17.51 12.63,18.08 11.57,18.08 9.92,19.73 8.02,17.82 2.03,17.82 1.6,18.25 F4.1
$4N2466: length 2.9
  Bottom Layer w0.254: 6.92,25.57 7.04,25.44
  Bottom Layer w1.5: F4.2 FB1.1
$5N816: length 4.9
  Bottom Layer w1: R16.2 15.67,14.97 16,14.97 16.05,15.02 R17.2
  vias: v1(16.91,15.57)
$5N931: length 3.3
  Bottom Layer w0.7: 18.3,9.97 R19.1
  vias: v1(14.86,10.4) v1(14.99,9.66) v1(15.49,10.33)
$6N1658: length 2
  Top Layer w0.254: U7.60 33.63,22.5 33.27,22.14 v1(33.27,21.76)
$6N2201: length 8.9
  Top Layer w0.5: J3.4 40.54,35.19 v1(41.72,34.02)
  Bottom Layer w0.5: v1(41.72,34.02) 41.72,33.13 41.28,32.68
  Bottom Layer w0.7: 39.88,31.29 41.15,32.56
  Bottom Layer w1: 39.88,31.29 38.91,30.32 F3.2
$6N2296: length 12.2
  Top Layer w0.5: v1(43.43,32.1) 41.22,32.1 40.64,32.68 39.03,32.68 J3.2
  Bottom Layer w0.254: R36.2 41.66,27.95 41.66,28.62 41.84,28.8 42.66,28.8 42.68,28.82 43.17,28.82 43.19,28.8 43.87,28.8 44.07,29 44.07,31.29 44.07,31.29 44.07,31.92 43.89,32.1 v1(43.43,32.1)
$6N2335: length 7.1
  Top Layer w0.254: J3.1 39.72,31.44 40.39,30.78 40.39,29 41.15,28.24 v1(42.93,28.24)
  Bottom Layer w0.254: v1(42.93,28.24) 42.93,27.6 R38.2
$6N2874: length 25.3
  Bottom Layer w0.8: C3.2 25.27,31.1 FB2.2 ; C3.2 C5.2 ; C3.2 27.77,30.08 28.41,30.72 28.41,30.86 28.88,31.33 29.01,31.33 31.39,33.7 BZ1.1 ; 31.12,33.95 28,37.07 C4.2 24.05,37.07 23.97,36.99 D3.1
$6N3165: length 10.3
  Top Layer w0.254: Q1.3 v1(24.26,35.86) v1(24.26,32.94)
  Bottom Layer w1: BZ1.2 25.19,35.37 25.19,35.45 23.45,33.72 D3.2 ; C4.1 24.45,35.67 v1(24.26,35.86)
$6N3346: length 1.7
  Top Layer w0.6: R5.2 23.37,34.54 Q1.1
$6N4575:
  vias: v1(26.86,8.95)
$6N4614:
  vias: v1(28.57,8.84)
$6N4653:
  vias: v1(30.48,8.71)
$6N4961:
  vias: v1(26.67,11.69)
$6N5000:
  vias: v1(24.76,11.74)
$6N5245: length 3.8
  Top Layer w0.254: Y1.1 32.31,28.88 32.31,27.78 32.13,27.6 31.12,27.6 30.83,27.32 U7.5
$6N5251: length 2.8
  Top Layer w0.254: U7.6 30.33,27.37 29.97,27.73 29.97,28.82 Y1.3
$6N5292: length 4.1
  Top Layer w0.254: R11.1 29.97,6.77 29.97,7.54 30.15,7.72 32,7.72 32.18,7.9 32.18,8.62 D9.1

## Copper pours and planes (outline as drawn; the poured copper is in the pictures)
+3.3V on Top Layer: 20.86,23.67 24.32,23.67 24,23.35 24,23.29 22.61,23.29 22.48,23.16 22.48,21.51 22.35,21.38 21.21,21.38 21.08,21.25 20.32,22.02 20.32,22.17 20.57,22.42 20.57,23.38
+3.3V on Top Layer: 21.97,17.19 25.4,17.19 25.4,16.47 24.26,15.33 24.26,15.28 21.46,15.28 21.34,15.41 21.34,16.54 21.27,16.6 21.27,17.18 21.41,17.32 21.84,17.32
+3.3V on Top Layer: 12.24,19.28 12.06,19.1 12.06,14.57 12.11,14.52 13.08,14.52 13.34,15.41 13.8,15.79 13.72,17.82 14.48,19.35 15.75,19.35 16.43,20.03 16.43,21.2 16.26,21.38 14.36,21.38 12.25,19.28
+3.3V on Top Layer: 32.51,16.17 32.83,15.85 32.83,14.3 33.17,14.3 33.53,14.65 33.53,15.95 33.21,16.27 32.51,16.27
+3.3V on Top Layer: 24.1,23.5 24.51,23.08 24.51,22.52 25.4,22.52 25.4,23.39 25.49,23.49 26.48,23.49 26.48,23.86 26.64,24.02 26.62,24.05 24.65,24.05
+3.3V on Top Layer: 12.26,15.16 12.26,14.52 11.94,14.19 10.49,14.19 10.41,14.27 10.33,14.18 10.33,12.41 10.29,12.36 11.81,12.36 11.94,12.24 11.94,13.63 12.81,14.5 12.98,14.5 12.98,15.09 12.91,15.16
+3.3V on Top Layer: 21.57,17.48 21.77,17.32 22.59,17.32 22.86,17.19 24.76,17.19 24.89,17.32 25.08,17.13 25.08,16.71 24.81,16.44 24.59,16.44 24.45,16.3 24.26,16.3 24.26,15.82 21.43,15.82 21.27,15.98 21.27,17.25 21.34,17.25
+3.3V on Top Layer: 33.02,27.86 33.02,27.91 33.04,27.93 35.15,27.93 35.15,26.49 35.18,26.46 34.13,26.46 34.78,24.72 35.35,24.5 33.56,24.27 32.96,23.67 32.7,23.67 31.94,24.43 31.94,24.82 31.3,25.45 32.39,25.45 32.77,25.83 32.77,27.66 32.97,27.86 33.02,27.86
+3.3V on Bottom Layer: 9.65,15.54 11.45,15.54 11.68,15.3 11.68,12.27 11.21,12.27 10.96,12.02 9.87,12.02 9.53,12.36 9.53,15.41
+3.3V on Bottom Layer: 25.12,23.5 25.12,22.37 23.75,21 23.75,20.87 21.62,20.87 21.21,21.51 19.74,21.51 19.43,21.2 19.43,21.15 19.25,21.15 18.67,21.73 18.67,22.4 18.54,22.52 19.67,22.52 19.95,22.81 20.24,22.81 20.57,23.14 21.81,23.14 22.28,22.27
+3.3V on Bottom Layer: 21.97,17.32 24.38,17.32 24.89,17.82 25.53,17.82 25.78,17.57 25.78,15.49 25.33,15.05 22.46,15.05 21.59,15.92 21.59,16.94
+3.3V on Bottom Layer: 31.12,27.86 34.8,27.86 35.94,30.35 36.73,26.6 34.36,26.84 33.66,26.84 33.53,26.71 33.53,23.56 33.34,23.37 32.47,23.37 32.38,23.29 32.38,24.17 31.88,24.68 31.12,24.68 30.94,24.86 30.79,24.86 30.23,25.43 30.23,25.44 30.48,25.7 30.48,27.05 31.12,27.68
+3.3V on Inner2: 10.16,15.28 10.2,15.28 10.34,15.15 12.1,16.92 12.26,14.7 12.26,12.43 12.1,12.27 10.12,12.27 10.12,13.42 10.03,13.51 10.03,15.3 10.14,15.3
+3.3V on Inner2: 31.33,25.95 31.33,24.72 31.37,24.68 32.63,24.68 32.94,24.38 33.44,24.38 33.98,24.92 33.98,26.14 34.35,26.51 33.98,26.51 33.66,26.84 32,26.84 31.88,26.97 31.86,26.97 31.33,26.45 31.33,25.99 31.3,25.95 31.3,25.95
+3.3V on Inner2: 19.09,23.5 21.46,23.5 22.44,22.52 22.48,22.52 22.48,21.51 22.16,21.19 18.22,21.19 18.03,21.38 18.03,22.08 18.35,22.4 18.35,22.76
+5V on Top Layer: 18.05,34.79 18.29,35.03 18.29,35.1 19.14,35.1 19.14,34.63 19.56,34.21 20.83,34.21 21.81,33.23 21.81,32.38 22.14,32.05 22.14,31.08 21.46,30.4 21.46,30.02 20.57,30.02 20.19,29.64 19.45,29.64 19.45,28.63 17.8,28.63 17.53,29.89 17.53,30.81 18.51,31.8 18.51,34.01 18.16,34.36 18.05,34.26
+5V on Bottom Layer: 19.05,33.96 21.59,33.96 21.72,33.83 21.72,30.27 21.14,29.69 20.57,29.69 20.01,29.13 19.94,29.13 19.3,28.49 19.18,28.49 18.97,28.29 17.09,28.29 16.89,28.49 16.89,31.03 17.41,31.55 18.24,31.55 18.24,32.51 18.8,33.06 18.8,33.7
+12V on Top Layer: 0.63,43.86 0.63,42.72 0.76,42.72 1.82,42.59 3.05,40.56 3.68,34.97 3.76,35.05 6.55,35.05 6.73,35.22 8.2,35.22 8.89,35.91 8.89,36.24 10.11,36.24 10.42,36.55 10.42,37.5 9.65,38.27 8.7,38.27 7.68,39.29 6.02,39.29 3.18,42.13 3.18,44 3.11,44.06 0.84,44.06
+12V on Bottom Layer: 4.83,39.92 4.87,39.97 8.38,39.97 8.38,34.72 6.73,34.72 6.22,34.21 6.22,32.62 5.46,31.86 5.26,32.06 1.15,32.06 0.51,32.7 0.51,34.21 3.05,34.21 3.68,35.35 4.06,39.29 4.57,39.8 4.57,39.92
GND on Top Layer: -6.86,72.82 58.93,72.82 58.93,-6.56 -6.86,-6.56
GND on Bottom Layer: -5.46,71.16 51.69,71.16 51.69,-5.29 -5.46,-5.29
GND on Inner1: 0.26,65.19 44.24,65.19 44.24,0.26 0.26,0.26
GND on Inner2: -4.83,69.01 50.93,69.01 50.93,-4.4 -4.83,-4.4
A_POWER on Top Layer: 4.83,16.81 1.27,13.25 0.38,13.25 0.38,7.66 2.79,6.99 8,13.34 8,13.63
B_POWER on Top Layer: 37.97,14.14 39.88,16.94 43.94,16.05 43.69,9.32 43.56,9.19 43.56,7.54 43.18,7.16 41.96,7.16 39.76,9.36 37.97,12.16
CAP+ on Top Layer: 38.63,3.2 39.2,3.2 39.34,3.35 40,3.35 41.02,4.36 42.54,4.36 43.69,3.22 43.69,0.34 40.77,0.55 37.56,0.55 37.26,0.85 37.26,1.84
CHASSIS+ on Top Layer: 13.23,6.8 13.23,5.78 12.83,5.38 9.17,5.38 6.7,2.69 8.51,0.55 11.43,0.55 15.37,4.49 15.37,7.79 14.22,7.79
CHASSIS+ on Bottom Layer: 6.86,8.79 6.86,6.78 6.48,6.39 7.49,5.38 7.49,1.82 8.89,0.43 11.18,0.43 12.7,1.95 12.7,3.98 10.79,5.89 9.78,5.89 9.78,8.43 9.14,9.06 7.11,9.06 6.86,8.81 7.73,7.94 7.73,7.92
IA+ on Top Layer: 7.37,9.4 7.37,6.27 7.49,6.14 12.06,6.14 12.19,6.01 12.19,7.49 12.26,7.56 11.65,8.17 10.67,8.17 9.64,9.2 9.64,9.4
IB+ on Top Layer: 35.05,6.06 35.05,8.5 36.9,8.5 37.97,7.43 37.97,6.65 38.75,5.87 39.24,5.87 39.24,3.98 39.12,3.85 37.26,3.85
IB+ on Top Layer: 36.06,9.57 35.05,8.57 35.05,9.44 34.93,9.57
REFEREE+ on Bottom Layer: 0.89,9.44 4.01,6.32 5.51,6.32 6.1,3.51 6.1,2.58 5.21,0.81 4.2,0.55 3.18,0.55 0.76,1.82 0.76,6.39 0.63,6.52 0.63,8.17 0.76,8.3 2.03,8.3 0.89,9.44
VPP on Top Layer: 11.3,32.3 13.36,32.3 13.36,28.01 11.18,25.83 11.18,25.32 9.53,25.32 9.53,27.02 8.76,27.78 5.92,27.78 5.72,27.98 5.72,29 5.59,29.13 5.84,29.38 10.41,29.38 10.79,29.76 10.79,30.94 11.3,31.45
VPP on Bottom Layer: 9.47,29.2 9.78,28.89 9.78,27.73 9.91,27.6 9.91,25.4 9.69,25.18 11.8,25.18 12.83,26.21 12.83,28.87 13.08,29.13 12.95,29.25 12.95,31.09 12.3,31.09 12.15,31.24 10.58,31.24 10.54,31.29 10.54,29.73 9.78,29.46
$2N395 on Bottom Layer: 6.75,32.61 6.75,31.91 6.86,31.79 6.93,31.87 9.98,31.87 10.16,32.05 10.16,33.32 9.78,33.32 9.65,33.45 8.2,33.45 7.81,33.06 7.37,33.06 6.87,32.56 6.87,32.49
$2N400 on Bottom Layer: 0.89,31.41 0.79,31.51 7.71,31.51 10.14,30.34 7.1,29.25 1.02,29.25 0.89,29.38
$2N898 on Bottom Layer: 15.48,34.49 15.68,34.29 15.68,33.3 17.88,33.3 18.8,34.21 18.8,34.46 19.72,34.92 20.32,34.66 21.41,34.66 21.46,34.72 21.46,35.99 21.59,36.11 19.18,35.73 17.3,34.49
$2N906 on Bottom Layer: 15.24,32.06 15.42,32.06 16.55,33.19 17.91,33.19 18.16,32.94 18.16,31.89 17.25,31.55 16.38,31.09 16.38,31.03 15.75,31.03 15.62,30.91 15.34,31.19 15.34,31.71 15.24,31.81

Small or netless copper shapes (teardrops, artwork), in the pictures only: 4 on Top Layer, 4 on Bottom Layer, 28 on Inner1, 1 on Inner2

## Text on the board
Bottom Silkscreen Layer: NTC | +12 | ASW | AHB | BHB | BSW | GND
Top Silkscreen Layer: REF+ | AH | AL | CHA+ | A_V | GND | REF_I | A_I | B_V | BH | BL | B_I | + / - / C / D | CAP+ | vpp | --by / leyiao
